# EAGLE schematic TimeLord (EAGLE 6.5.0)
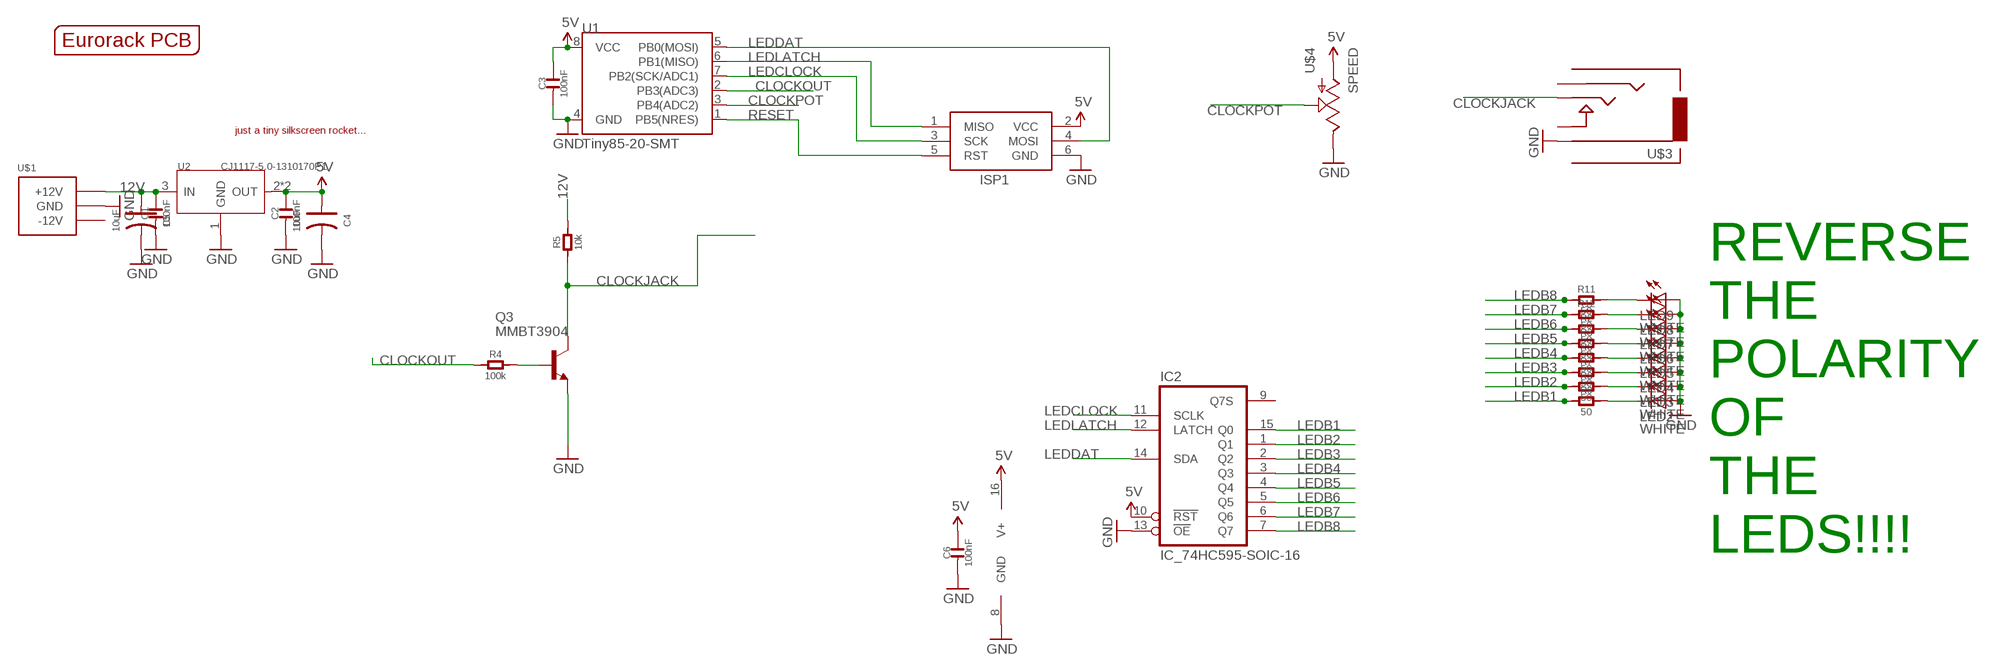
[diagram p0: schematic, sheet 1]

## Parts
C1  100nF  C-0603  [C0603]
C2  100nF  C-0603  [C0603]
C3  100nF  C-0603  [C0603]
C4  10uF  C-POLAR-A  [AVX-A]
C5  10uF  C-POLAR-A  [AVX-A]
C6  100nF  C-0603  [C0603]
IC2  IC_74HC595-SOIC-16  [SOIC-16]
ISP1  AVRISP-6  [AVRISP]
LED2  WHITE  LED3MM  [LED3MM]
LED3  WHITE  LED3MM  [LED3MM]
LED4  WHITE  LED3MM  [LED3MM]
LED5  WHITE  LED3MM  [LED3MM]
LED6  WHITE  LED3MM  [LED3MM]
LED7  WHITE  LED3MM  [LED3MM]
LED8  WHITE  LED3MM  [LED3MM]
LED9  WHITE  LED3MM  [LED3MM]
Q3  MMBT3904  MMBT3904LT1-NPN-SOT23-BEC  [SOT23-BEC]
R2  50  R-0603  [R0603]
R3  50  R-0603  [R0603]
R4  100k  R-0603  [R0603]
R5  10k  R-0603  [R0603]
R6  50  R-0603  [R0603]
R7  50  R-0603  [R0603]
R8  50  R-0603  [R0603]
R9  50  R-0603  [R0603]
R11  50  R-0603  [R0603]
R12  50  R-0603  [R0603]
U1  Tiny85-20-SMT  ATTINY45TINY85-20-SMT  [SO08-EIAJ]
U2  CJ1117-5.0-1310170P1  [SOT223]
U$1  POWER_SIMPLE10-OTHERSIDE  [POWER_10_LABELSOTHERSIDE]
U$2  EURORACK_PCB4HP  [EURORACK4HPPCB]
U$3  CLOCK  AUDIO-JACKOUTPUT  [3.5MM-JACK-SWITCH-13MM-OUTPUT]
U$4  SPEED  POTZEPHPOT  [OG-POTS_ALPS_POT_VERTICAL]
U$5  JUSTATINYROCKET  [JUSTATINYROCKET]

## Nets
5V: C2.2 C3.2 C4.+ C6.2 IC2.10(!RST) IC2.16(V+) ISP1.2(VCC) U1.8(VCC) U2.2(OUT) U2.TER(OUT) U$4.P$3(A)
12V: C1.2 C5.+ R5.2 U2.3(IN) U$1.9(+12V) U$1.10(+12V)
CLOCKJACK: Q3.C R5.1 U$3.TIP@1(TIP) U$3.TIP@2(TIP)
CLOCKOUT: R4.1 U1.2(PB3(ADC3))
CLOCKPOT: U1.3(PB4(ADC2)) U$4.P$2(S)
GND: C1.1 C2.1 C3.1 C4.- C5.- C6.1 IC2.8(GND) IC2.13(!OE) ISP1.6(GND) LED2.A LED3.A LED4.A LED5.A LED6.A LED7.A LED8.A LED9.A Q3.E U1.4(GND) U2.1(GND) U$1.3(GND) U$1.4(GND) U$1.5(GND) U$1.6(GND) U$1.7(GND) U$1.8(GND) U$3.RING@1(RING) U$3.RING@2(RING) U$4.P$1(E)
LEDB1: IC2.15(Q0) R9.1
LEDB2: IC2.1(Q1) R8.1
LEDB3: IC2.2(Q2) R7.1
LEDB4: IC2.3(Q3) R6.1
LEDB5: IC2.4(Q4) R3.1
LEDB6: IC2.5(Q5) R2.1
LEDB7: IC2.6(Q6) R12.1
LEDB8: IC2.7(Q7) R11.1
LEDCLOCK: IC2.11(SCLK) ISP1.3(SCK) U1.7(PB2(SCK/ADC1))
LEDDAT: IC2.14(SDA) ISP1.4(MOSI) U1.5(PB0(MOSI))
LEDLATCH: IC2.12(LATCH) ISP1.1(MISO) U1.6(PB1(MISO))
N$1: LED8.K(C) R12.2
N$8: LED9.K(C) R11.2
N$9: Q3.B R4.2
N$14: LED7.K(C) R2.2
N$15: LED6.K(C) R3.2
N$16: LED5.K(C) R6.2
N$17: LED4.K(C) R7.2
N$18: LED3.K(C) R8.2
N$19: LED2.K(C) R9.2
RESET: ISP1.5(RST) U1.1(PB5(NRES))
Unconnected: IC2.9(Q7S) U$1.1(-12V) U$1.2(-12V) U$3.SECOND@1(SECOND) U$3.SECOND@2(SECOND) U$3.SWITCH@1(SWITCH) U$3.SWITCH@2(SWITCH)

## Notes on the sheet
- REVERSE 
  THE 
  POLARITY 
  OF 
  THE 
  LEDS!!!!

## Library data of the parts
C1-C3 C6 = OPL:C*
C4 C5 = OPL:C-POLAR*
IC2 = dp_devices:IC_74HC595: 8-bit serial-in parallel out shift register, output latch 3-state
ISP1 = adafruit:AVRISP: AVR ISP HEADER Standard 6 pin header for AVR programming
LED2-LED9 = SparkFun-LED:LED: LEDs Standard schematic elements and footprints for 5mm, 3mm, 1206, and 0603 sized LEDs. 5mm - Spark Fun Electronics SKU : COM-00529 (and others)
Q3 = transistor:*-NPN-: NPN Transistror BF959 corrected 2008.03.06
R2-R9 R11 R12 = OPL:R*
U1 = SparkFun-DigitalIC:ATTINY45: Atmel 8-pin 2/4/8kB flash uC; PROD_ID: IC-09092
U2 = OPL:CJ1117-5.0
U$1 = EurorackModularParts:POWER_SIMPLE
U$2 = EurorackModularParts:EURORACK_PCB
U$3 = EurorackModularParts:AUDIO-JACK: Switching Mono 3.5mm Audio Jack from Erthenvar.
U$4 = EurorackModularParts:POT
U$5 = zephod-components:JUSTATINYROCKET

## Net classes
0 default: width 0.381 mm